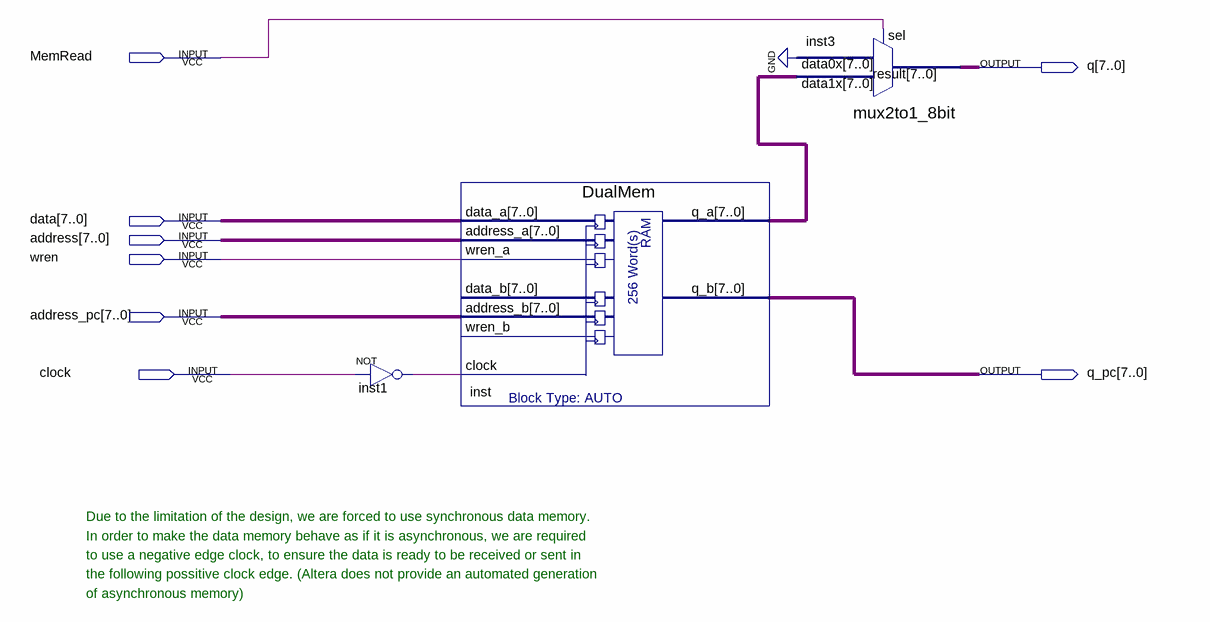
[diagram p0: schematic sheet]
// Quartus schematic memory.bdf as structural Verilog: 3 symbols, 8 pins
module memory (
  input  MemRead,
  input  [7:0] data,
  input  [7:0] address,
  input  wren,
  input  [7:0] address_pc,
  input  clock,
  output [7:0] q,
  output [7:0] q_pc
);

  wire inst1_out;
  wire [7:0] inst_q_a;

  not inst1 (inst1_out, clock);
  DualMem inst (
    .data_a(data), .address_a(address), .wren_a(wren), .address_b(address_pc), .clock(inst1_out),
    .q_a(inst_q_a), .q_b(q_pc));  // open: data_b, wren_b
  mux2to1_8bit inst3 (.data1x(inst_q_a), .data0x({8{1'b0}}), .sel(MemRead), .result(q));

  // Notes on the sheet:
  //   Due to the limitation of the design, we are forced to use synchronous data memory.
  //   In order to make the data memory behave as if it is asynchronous, we are required
  //   to use a negative edge clock, to ensure the data is ready to be received or sent in
  //   the following possitive clock edge. (Altera does not provide an automated generation
  //   of asynchronous memory)
endmodule
